# Altium schematic sheet Sheet_1_2024-11-29.schdoc
size 299 x 237 mm
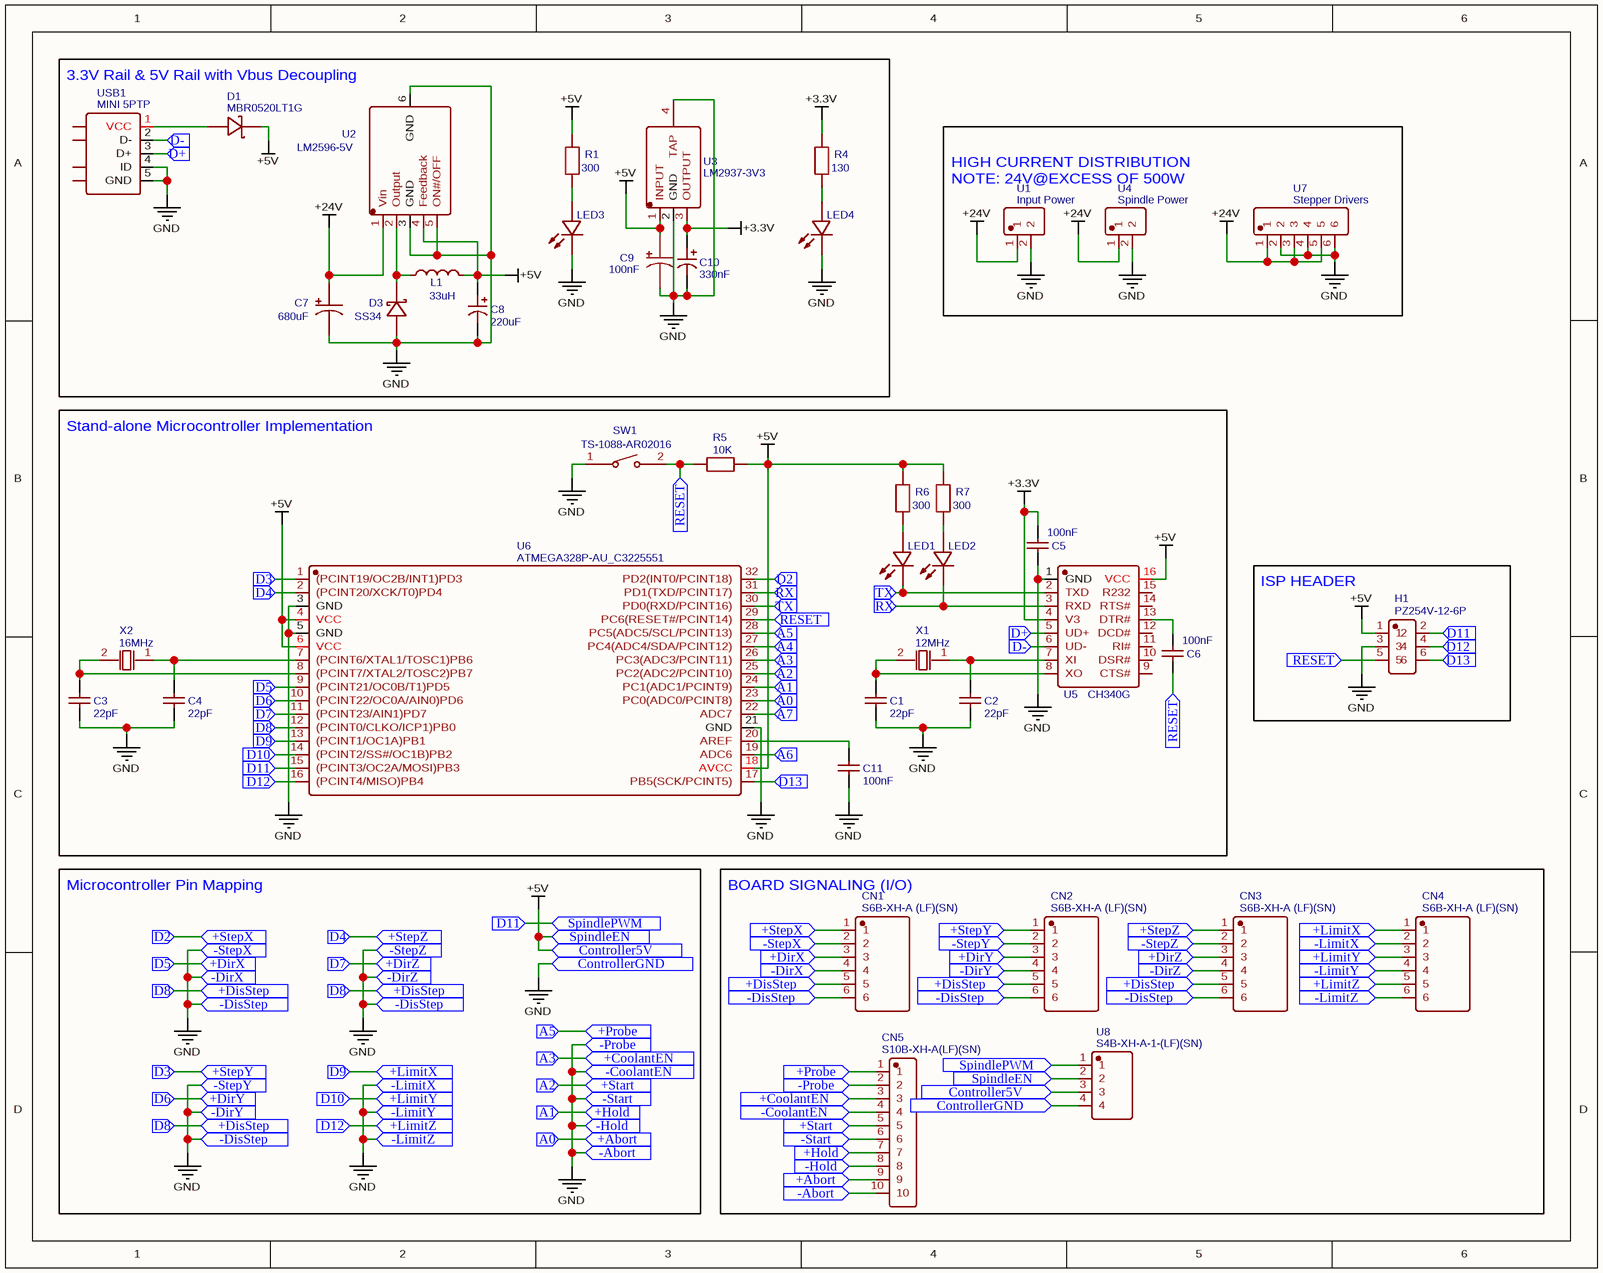
[diagram p0: Sheet_1_2024-11-29.schdoc]

## Parts
C1  22pF  [C0603]
C2  22pF  [C0603]
C3  22pF  [C0603]
C4  22pF  [C0603]
C5  100nF  [C0603]
C6  100nF  [C0603]
C7  680uF  [CAP-SMD_BD18.0-L19.0-W19.0-FD]
C8  220uF  [CAP-SMD_BD6.3-L6.6-W6.6-FD]
C9  100nF  [CAP-SMD_BD4.0-L4.3-W4.3-FD]
C10  330nF  [CAP-SMD_BD4.0-L4.3-W4.3-LS5.3-FD]
C11  100nF  [C0603]
CN1  S6B-XH-A (LF)(SN)  [CONN-TH_S6B-XH-A-LF-SN]
CN2  S6B-XH-A (LF)(SN)  [CONN-TH_S6B-XH-A-LF-SN]
CN3  S6B-XH-A (LF)(SN)  [CONN-TH_S6B-XH-A-LF-SN]
CN4  S6B-XH-A (LF)(SN)  [CONN-TH_S6B-XH-A-LF-SN]
CN5  S10B-XH-A(LF)(SN)  [CONN-TH_10P-P2.50_S10B-XH-A-LF-SN]
D1  MBR0520LT1G  [SOD-123_L2.8-W1.8-LS3.7-RD]
D3  SS34  [SMB_L4.3-W3.6-LS5.4-RD]
H1  PZ254V-12-6P  [HDR-TH_6P-P2.54-V-M-R2-C3-S2.54]
L1  33uH  [IND-SMD_L12.3-W12.3]
LED1  SZYY0603O  [LED0603-R-RD_ORANGE]  (value not drawn)
LED2  SZYY0603O  [LED0603-R-RD_ORANGE]  (value not drawn)
LED3  SZYY0603O  [LED0603-R-RD_ORANGE]  (value not drawn)
LED4  SZYY0603O  [LED0603-R-RD_ORANGE]  (value not drawn)
R1  300  [R0603]
R4  130  [R0603]
R5  10K  [R0603]
R6  300  [R0603]
R7  300  [R0603]
SW1  TS-1088-AR02016  [SW-SMD_L3.9-W3.0-P4.45]
U1  Input Power  [CONN-TH_2P-P9.50_DBT50G-9.5-2P]
U2  LM2596-5V  [TO-263-5_L10.0-W9.0-P1.70-LS15.2-BR]
U3  LM2937-3V3  [SOT-223_L6.5-W3.5-P2.30-LS7.0-BR]
U4  Spindle Power  [CONN-TH_2P-P9.50_DBT50G-9.5-2P]
U5  CH340G  [SOIC-16_L9.9-W3.9-P1.27-LS6.0-BL]
U6  ATMEGA328P-AU_C3225551  [TQFP-32_L7.0-W7.0-P0.80-LS9.0-BL]
U7  Stepper Drivers  [CONN-TH_6P-P9.50_DBT50G-9.5-6P]
U8  S4B-XH-A-1-(LF)(SN)  [CONN-TH_4P-P2.50_S4B-XH-A-1-LF-SN]
USB1  MINI 5PTP  [MINI-USB-SMD_MINI-5PTP]
X1  12MHz  [HC-49US_L11.0-W4.6-P4.88]
X2  16MHz  [HC-49US_L11.0-W4.6-P4.88]

## Blocks framed on the sheet
3.3V Rail & 5V Rail with Vbus Decoupling: C7-C10 D1 D3 L1 LED3 LED4 R1 R4 U2 U3 USB1
Stand-alone Microcontroller Implementation: C1-C6 C11 LED1 LED2 R5-R7 SW1 U5 U6 X1 X2
ISP HEADER: H1
BOARD SIGNALING (I/O): CN1-CN5 U8

## Ports
+Abort (in), +CoolantEN (in), +DirX (in), +DirY (in), +DirZ (in), +DisStep (in), +Hold (in), +LimitX (in), +LimitY (in), +LimitZ (in), +Probe (in), +Start (in), +StepX (in), +StepY (in), +StepZ (in), -Abort (in), -CoolantEN (in), -DirX (in), -DirY (in), -DirZ (in), -DisStep (in), -Hold (in), -LimitX (in), -LimitY (in), -LimitZ (in), -Probe (in), -Start (in), -StepX (in), -StepY (in), -StepZ (in), A0 (in), A1 (in), A2 (in), A3 (in), A4 (in), A5 (in), A6 (in), A7 (in), Controller5V (in), ControllerGND (in), D2 (in), D3 (in), D4 (in), D5 (in), D6 (in), D7 (in), D8 (in), D9 (in), D10 (in), D11 (in), D12 (in), D13 (in), D+ (in), D- (in), RESET (in), RX (in), SpindleEN (in), SpindlePWM (in), TX (in)

## Nets
+3.3V: C5.1 C10.1 R4.2 U3.3(OUTPUT) U5.4(V3)
+5V: C8.1 C9.1 D1.1(C) H1.1 L1.2 R1.2 R5.1 R6.2 R7.2 U2.4(Feedback) U3.1(INPUT) U5.16(VCC) U6.4(VCC) U6.6(VCC) U6.18(AVCC) U8.2 U8.3 ; port SpindleEN, port Controller5V
+24V: C7.1 U1.1 U2.1(Vin) U4.1 U7.1 U7.3 U7.5
GND: C1.1 C2.1 C3.1 C4.1 C5.2 C7.2 C8.2 C9.2 C10.2 C11.1 CN1.2 CN1.4 CN1.6 CN2.2 CN2.4 CN2.6 CN3.2 CN3.4 CN3.6 CN4.2 CN4.4 CN4.6 CN5.2 CN5.4 CN5.6 CN5.8 CN5.10 D3.2(A) H1.3 LED3.2(-) LED4.2(-) SW1.1 U1.2 U2.3(GND) U2.5(ON#/OFF) U2.6(GND) U3.2(GND) U3.4(TAP) U4.2 U5.1(GND) U6.3(GND) U6.5(GND) U6.21(GND) U7.2 U7.4 U7.6 U8.4 USB1.4(ID) USB1.5(GND) ; port -StepX, port -DirX, port -DisStep, port -DirY, port -StepY, port -DirZ, port -StepZ, port -LimitZ, port -LimitY, port -LimitX, port ControllerGND, port -Probe, port -CoolantEN, port -Start, port -Hold, port -Abort
+Abort: CN5.9 U6.23(PC0(ADC0/PCINT8)) ; port A0, port +Abort
+CoolantEN: CN5.3 U6.26(PC3(ADC3/PCINT11)) ; port A3, port +CoolantEN
+DirX: CN1.3 U6.9((PCINT21/OC0B/T1)PD5) ; port D5, port +DirX
+DirY: CN2.3 U6.10((PCINT22/OC0A/AIN0)PD6) ; port D6, port +DirY
+DirZ: CN3.3 U6.11((PCINT23/AIN1)PD7) ; port D7, port +DirZ
+DisStep: CN1.5 CN2.5 CN3.5 U6.12((PCINT0/CLKO/ICP1)PB0) ; port D8, port +DisStep
+Hold: CN5.7 U6.24(PC1(ADC1/PCINT9)) ; port A1, port +Hold
+LimitX: CN4.1 U6.13((PCINT1/OC1A)PB1) ; port D9, port +LimitX
+LimitY: CN4.3 U6.14((PCINT2/SS#/OC1B)PB2) ; port D10, port +LimitY
+LimitZ: CN4.5 H1.4 U6.16((PCINT4/MISO)PB4) ; port D12, port +LimitZ
+Probe: CN5.1 U6.28(PC5(ADC5/SCL/PCINT13)) ; port A5, port +Probe
+Start: CN5.5 U6.25(PC2(ADC2/PCINT10)) ; port A2, port +Start
+StepX: CN1.1 U6.32(PD2(INT0/PCINT18)) ; port D2, port +StepX
+StepY: CN2.1 U6.1((PCINT19/OC2B/INT1)PD3) ; port D3, port +StepY
+StepZ: CN3.1 U6.2((PCINT20/XCK/T0)PD4) ; port D4, port +StepZ
A4: U6.27(PC4(ADC4/SDA/PCINT12)) ; port A4
A6: U6.19(ADC6) ; port A6
A7: U6.22(ADC7) ; port A7
D11: H1.2 U6.15((PCINT3/OC2A/MOSI)PB3) U8.1 ; port D11, port SpindlePWM
D13: H1.6 U6.17(PB5(SCK/PCINT5)) ; port D13
D+: U5.5(UD+) USB1.3(D+) ; port D+
D-: U5.6(UD-) USB1.2(D-) ; port D-
RESET: C6.2 H1.5 R5.2 SW1.2 U6.29(PC6(RESET#/PCINT14)) ; port RESET
RX: LED2.2(-) U5.3(RXD) U6.31(PD1(TXD/PCINT17)) ; port RX
TX: LED1.2(-) U5.2(TXD) U6.30(PD0(RXD/PCINT16)) ; port TX
NetC1_2: C1.2 U5.8(XO) X1.2(OSC2)
NetC2_2: C2.2 U5.7(XI) X1.1(OSC1)
NetC3_2: C3.2 U6.8((PCINT7/XTAL2/TOSC2)PB7) X2.2(OSC2)
NetC4_2: C4.2 U6.7((PCINT6/XTAL1/TOSC1)PB6) X2.1(OSC1)
NetC6_1: C6.1 U5.13(DTR#)
NetC11_2: C11.2 U6.20(AREF)
NetD1_2: D1.2(A) USB1.1(VCC)
NetD3_1: D3.1(K) L1.1 U2.2(Output)
NetLED1_1: LED1.1(+) R6.1
NetLED2_1: LED2.1(+) R7.1
NetLED3_1: LED3.1(+) R1.1
NetLED4_1: LED4.1(+) R4.1

Not connected (* = marked no-connect by the designer): U5 9(CTS#) 10(DSR#) 11(RI#) 12(DCD#) 14(RTS#) 15(R232); USB1 6(EH) 7(EH) 8(EH) 9(EH)

## Notes on the sheet
- (near U1) HIGH CURRENT DISTRIBUTION
  NOTE: 24V@EXCESS OF 500W
- Microcontroller Pin Mapping

## Library data of the parts
C1-C4 = 22pF: Manufacturer: YAGEO(国巨); nameAlias: Value; Supplier: LCSC; Supplier Part: C105620; JLCPCB Part Class: Extended Part; spicePre: C; spiceSymbolName: CC0603JRNPO9BN220
C5 C6 C11 = 100nF: Manufacturer: YAGEO(国巨); nameAlias: Value; Supplier: LCSC; Supplier Part: C105620; JLCPCB Part Class: Extended Part; spicePre: C; spiceSymbolName: CC0603JRNPO9BN220
C7 = 680uF: Manufacturer: lelon(立隆); nameAlias: Value; Contributor: LCSC; Supplier: LCSC; Supplier Part: C249956; JLCPCB Part Class: Extended Part; spicePre: C; spiceSymbolName: VZH681M1J1816-TRO
C8 = 220uF: Manufacturer: KNSCHA(科尼盛); nameAlias: Value; Contributor: lcsc; Supplier: LCSC; Supplier Part: C5138966; JLCPCB Part Class: Extended Part; spicePre: C; spiceSymbolName: RST220UF16V167RV0019
C9 = 100nF: Manufacturer: HUAWEI(华威集团); Manufacturer Part: VT1H0R1MB054000CE0; nameAlias: Capacitance; Contributor: LCSC; Supplier: LCSC; Supplier Part: C271438; JLCPCB Part Class: Extended Part; spicePre: C; spiceSymbolName: VT1H0R1MB054000CE0
C10 = 330nF: Manufacturer: ST(先科); Manufacturer Part: CK1HR33MCRC54; nameAlias: Capacitance; Contributor: LCSC; Supplier: LCSC; Supplier Part: C264238; JLCPCB Part Class: Extended Part; spicePre: C; spiceSymbolName: CK1HR33MCRC54
CN1-CN4 = S6B-XH-A (LF)(SN): Manufacturer: JST; Contributor: LCSC; Supplier: LCSC; Supplier Part: C157919; JLCPCB Part Class: Extended Part; spicePre: C; spiceSymbolName: S6B-XH-A (LF)(SN)
CN5 = S10B-XH-A(LF)(SN): Manufacturer: JST; Contributor: LCSC; Supplier: LCSC; Supplier Part: C378989; JLCPCB Part Class: Extended Part; spicePre: C; spiceSymbolName: S10B-XH-A(LF)(SN)
D1 = MBR0520LT1G: Manufacturer: onsemi(安森美); Supplier: LCSC; Supplier Part: C23848; JLCPCB Part Class: Extended Part; spicePre: D; spiceSymbolName: MBR0520LT1G
D3 = SS34: Manufacturer: DOWO(东沃); Contributor: lcsc; Supplier: LCSC; Supplier Part: C2959729; JLCPCB Part Class: Extended Part; spicePre: D; spiceSymbolName: SS34_C2959729
H1 = PZ254V-12-6P: Manufacturer: XFCN(兴飞); Contributor: LCSC; Supplier: LCSC; Supplier Part: C492420; JLCPCB Part Class: Extended Part; spicePre: H; spiceSymbolName: PZ254V-12-6P
L1 = 33uH: Manufacturer: GLE(格莱尔); nameAlias: Value; Contributor: lcsc; Supplier: LCSC; Supplier Part: C439412; JLCPCB Part Class: Extended Part; spicePre: L; spiceSymbolName: GCRH127-330MC
LED1-LED4 = SZYY0603O: Manufacturer: yongyu(永裕光电); Contributor: LCSC; Supplier: LCSC; Supplier Part: C434425; JLCPCB Part Class: Extended Part; spicePre: L; spiceSymbolName: SZYY0603O
R1 R6 R7 = 300: Manufacturer: Milliohm(毫欧); Contributor: lcsc; nameAlias: Value; Supplier: LCSC; Supplier Part: C5123581; spicePre: U; spiceSymbolName: HOAR0603-1/10W-10KR-0.1%-TCR25
R4 = 130: Manufacturer: Milliohm(毫欧); Contributor: lcsc; nameAlias: Value; Supplier: LCSC; Supplier Part: C5123581; spicePre: U; spiceSymbolName: HOAR0603-1/10W-10KR-0.1%-TCR25
R5 = 10K: Manufacturer: Milliohm(毫欧); Contributor: lcsc; nameAlias: Value; Supplier: LCSC; Supplier Part: C5123581; spicePre: U; spiceSymbolName: HOAR0603-1/10W-10KR-0.1%-TCR25
SW1 = TS-1088-AR02016: Manufacturer: XUNPU(讯普); Contributor: LCSC; Supplier: LCSC; Supplier Part: C720477; Manufacturer Part: TS-1088-AR02016; JLCPCB Part Class: Extended Part; spicePre: S; spiceSymbolName: TS-1088-AR02016
U1 = Input Power: Manufacturer: DORABO(地博电气); Contributor: LCSC; Supplier: LCSC; Supplier Part: C395958; JLCPCB Part Class: Extended Part; spicePre: U; spiceSymbolName: DBT50G-9.5-2P
U2 = LM2596-5V: Manufacturer: MSKSEMI(美森科); Contributor: lcsc; Supplier: LCSC; Supplier Part: C5189813; spicePre: U; spiceSymbolName: LM2596S-12-MS
U3 = LM2937-3V3: Manufacturer: TI(德州仪器); Contributor: LCSC; Supplier: LCSC; Supplier Part: C140265; JLCPCB Part Class: Extended Part; spicePre: U; spiceSymbolName: LM2937IMP-3.3/NOPB
U4 = Spindle Power: Manufacturer: DORABO(地博电气); Contributor: LCSC; Supplier: LCSC; Supplier Part: C395958; JLCPCB Part Class: Extended Part; spicePre: U; spiceSymbolName: DBT50G-9.5-2P
U5 = CH340G: Manufacturer: WCH(南京沁恒); timeStamp: 1468327462; Supplier: LCSC; Supplier Part: C14267; JLCPCB Part Class: Extended Part; spicePre: U; spiceSymbolName: CH340G
U6 = ATMEGA328P-AU_C3225551: Manufacturer: MICROCHIP(美国微芯); Contributor: lcsc; Supplier: LCSC; Supplier Part: C3225551; JLCPCB Part Class: Extended Part; spicePre: U; spiceSymbolName: ATMEGA328P-AU_C3225551
U7 = Stepper Drivers: Manufacturer: DORABO(地博电气); Contributor: LCSC; Supplier: LCSC; Supplier Part: C430698; JLCPCB Part Class: Extended Part; spicePre: U; spiceSymbolName: DBT50G-9.5-6P
U8 = S4B-XH-A-1-(LF)(SN): Manufacturer: JST; Contributor: LCSC; Supplier: LCSC; Supplier Part: C163037; JLCPCB Part Class: Extended Part; spicePre: U; spiceSymbolName: S4B-XH-A-1-(LF)(SN)
USB1 = MINI 5PTP: Manufacturer: SHOU HAN(首韩); Contributor: LCSC; Supplier: LCSC; Supplier Part: C2681563; JLCPCB Part Class: Extended Part; spicePre: U; spiceSymbolName: MINI 5PTP
X1 = 12MHz: Manufacturer: ECS; Contributor: lcsc; nameAlias: Value; Supplier: LCSC; Supplier Part: C2649031; JLCPCB Part Class: Extended Part; spicePre: X; spiceSymbolName: ECS-160-18-4X-CKM
X2 = 16MHz: Manufacturer: ECS; Contributor: lcsc; nameAlias: Value; Supplier: LCSC; Supplier Part: C2649031; JLCPCB Part Class: Extended Part; spicePre: X; spiceSymbolName: ECS-160-18-4X-CKM